# EAGLE schematic Power_Delivery_Schematic (EAGLE 9.7.0)
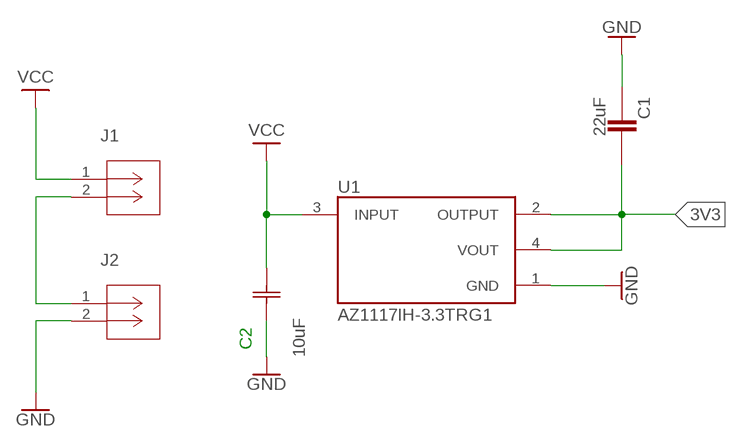
[diagram p0: schematic, sheet 1]

## Parts
C1  22uF  CL21A226KPCLRNC  [CAPC2012X140N]
C2  10uF  GRM21BR61C106KE15LG-21_MUR-L  [G-21_MUR-L]
J1  B2B-PH-K-S(LF)(SN)CONN_B2B-PH-K-S(LF)(SN)_JST  [CONN_B2B-PH-K-S(LF)(SN)_JST]
J2  B2B-PH-K-S(LF)(SN)CONN_B2B-PH-K-S(LF)(SN)_JST  [CONN_B2B-PH-K-S(LF)(SN)_JST]
U1  AZ1117IH-3.3TRG1  [SOT230P700X185-4N]

## Nets
3V3: C1.2 U1.2(OUTPUT) U1.4(VOUT)
GND: C1.1 C2.1 J2.2 U1.1(GND)
N$1: J1.2 J2.1
VCC: C2.2 J1.1 U1.3(INPUT)

## Library data of the parts
C1 = CL21A226KPCLRNC:CL21A226KPCLRNC: 22µF ±20% 25V Ceramic Capacitor X5R 0805 (2012 Metric); MANUFACTURER: Samsung
C2 = 2023-10-24_23-38-18_Library:GRM21BR61C106KE15L; COPYRIGHT: Copyright (C) 2023 Ultra Librarian. All rights reserved.; MANUFACTURER_PART_NUMBER: GRM21BR61C106KE15L; MFR_NAME: Murata
J1 J2 = 2023-10-24_23-33-47_Library:B2B-PH-K-S(LF)(SN); COPYRIGHT: Copyright (C) 2023 Ultra Librarian. All rights reserved.; MANUFACTURER_PART_NUMBER: B2B-PH-K-S(LF)(SN); MFR_NAME: JST
U1 = AZ1117IH-3.3TRG1:AZ1117IH-3.3TRG1: Check availability <https://pricing.snapeda.com/parts/AZ1117IH-3.3TRG1/Diodes%20Inc./view-part?ref=eda>; AVAILABILITY: In Stock; CHECK_PRICES: https://www.snapeda.com/parts/AZ1117IH-3.3TRG1/Diodes+Inc./view-part/?ref=eda; DESCRIPTION: Linear Voltage Regulator IC Positive Fixed 1 Output 1A SOT-223-3; MF: Diodes Inc.; MP: AZ1117IH-3.3TRG1; PACKAGE: SOT-223 Diodes Inc.; PRICE: None; PURCHASE-URL: https://www.snapeda.com/api/url_track_click_mouser/?unipart_id=490259&manufacturer=Diodes Inc.&part_name=AZ1117IH-3.3TRG1&search_term=az1117ih-3.3trg1; SNAPEDA_LINK: https://www.snapeda.com/parts/AZ1117IH-3.3TRG1/Diodes+Inc./view-part/?ref=snap